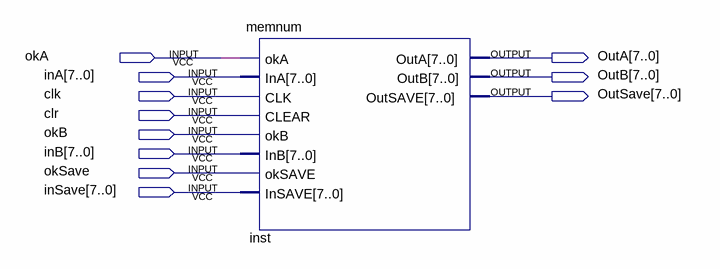
[diagram p0: schematic sheet]
// Quartus schematic teste.bdf as structural Verilog: 1 symbols, 11 pins
module teste (
  input  okA,
  input  [7:0] inA,
  input  clk,
  input  clr,
  input  okB,
  input  [7:0] inB,
  input  okSave,
  input  [7:0] inSave,
  output [7:0] OutA,
  output [7:0] OutB,
  output [7:0] OutSave
);

  memnum inst (
    .okA(okA), .InA(inA), .CLK(clk), .CLEAR(clr), .okB(okB), .InB(inB), .okSAVE(okSave), .InSAVE(inSave),
    .OutA(OutA), .OutB(OutB), .OutSAVE(OutSave));
endmodule
